# Altium schematic sheet Main.SchDoc: Molniya Relay Attenuator
size A4; DrawnBy: I.Vasilev
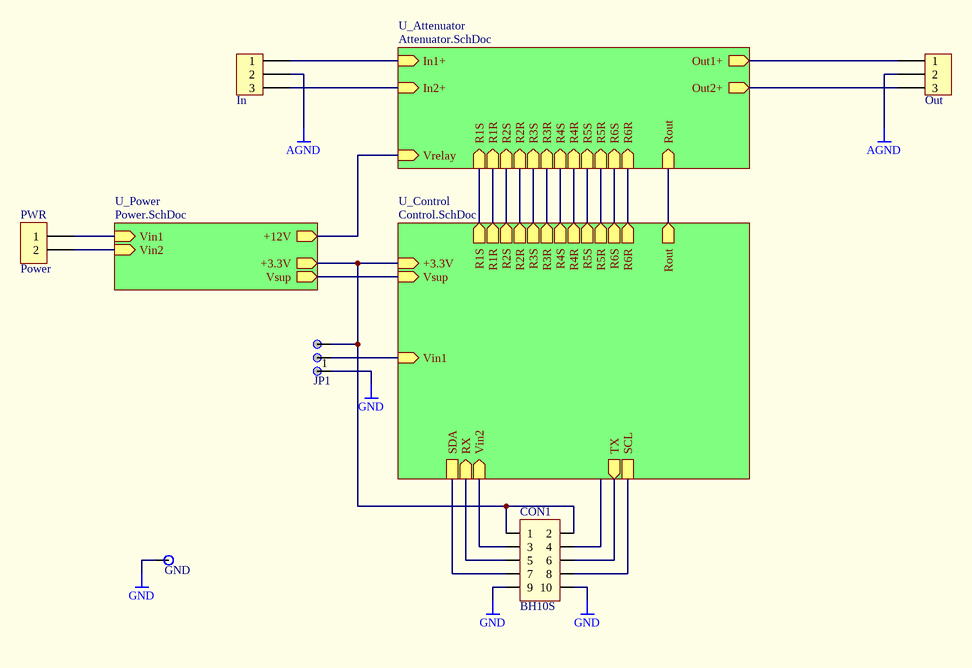
[diagram p0: Main.SchDoc]

## Parts
CON1  BH10S  [BH10S]
GND  TESTPAD  [MISC_PAD-36/65]  (value not drawn)
In  CON3  [CON_WS03S]  (value not drawn)
JP1  Jumper, 3pin  [JP3]  (value not drawn)
Out  CON3  [CON_WS03S]  (value not drawn)
PWR  Power  [CONN_TOP_2P]

## Sub-sheets
U_Attenuator = Attenuator.SchDoc: Vrelay (in), R1S (in), R1R (in), R2S (in), R2R (in), R3S (in), R3R (in), R4S (in), R4R (in), R5S (in), R5R (in), R6S (in), R6R (in), In1+ (in), In2+ (in), Out1+ (out), Out2+ (out), Rout (in)
U_Control = Control.SchDoc: R1S (out), R1R (out), R2S (out), R2R (out), R3S (out), R3R (out), R4S (out), R4R (out), R5S (out), R5R (out), R6S (out), R6R (out), SDA, SCL, Vsup (in), Rout (out), TX (out), RX (in), +3.3V (in), Vin1 (in), Vin2 (in)
U_Power = Power.SchDoc: Vin1 (in), Vin2 (in), +12V (out), +3.3V (out), Vsup (out)

## Nets
AGND: In.2 Out.2
GND: CON1.9 CON1.10 GND.1 JP1.1
NetCON1_1: CON1.1 CON1.2 JP1.3 ; sheet U_Control/+3.3V, sheet U_Power/+3.3V
NetCON1_3: CON1.3 ; sheet U_Control/Vin2
NetCON1_5: CON1.5 ; sheet U_Control/RX
NetCON1_6: CON1.6 ; sheet U_Control/TX
NetCON1_7: CON1.7 ; sheet U_Control/SDA
NetCON1_8: CON1.8 ; sheet U_Control/SCL
NetIn_1: In.1 ; sheet U_Attenuator/In1+
NetIn_3: In.3 ; sheet U_Attenuator/In2+
NetJP1_2: JP1.2 ; sheet U_Control/Vin1
NetOut_1: Out.1 ; sheet U_Attenuator/Out1+
NetOut_3: Out.3 ; sheet U_Attenuator/Out2+
NetPWR_1: PWR.1 ; sheet U_Power/Vin1
NetPWR_2: PWR.2 ; sheet U_Power/Vin2
(unnamed): sheet U_Attenuator/Vrelay, sheet U_Power/+12V
(unnamed): sheet U_Attenuator/R1S, sheet U_Control/R1S
(unnamed): sheet U_Attenuator/R1R, sheet U_Control/R1R
(unnamed): sheet U_Attenuator/R2S, sheet U_Control/R2S
(unnamed): sheet U_Attenuator/R2R, sheet U_Control/R2R
(unnamed): sheet U_Attenuator/R3S, sheet U_Control/R3S
(unnamed): sheet U_Attenuator/R3R, sheet U_Control/R3R
(unnamed): sheet U_Attenuator/R4S, sheet U_Control/R4S
(unnamed): sheet U_Attenuator/R4R, sheet U_Control/R4R
(unnamed): sheet U_Attenuator/R5S, sheet U_Control/R5S
(unnamed): sheet U_Attenuator/R5R, sheet U_Control/R5R
(unnamed): sheet U_Attenuator/R6S, sheet U_Control/R6S
(unnamed): sheet U_Attenuator/R6R, sheet U_Control/R6R
(unnamed): sheet U_Attenuator/Rout, sheet U_Control/Rout
(unnamed): sheet U_Control/Vsup, sheet U_Power/Vsup

Not connected (* = marked no-connect by the designer): CON1 4

## Library data of the parts
CON1 = CON2x5: BH10S-side mounted
In Out = CON3: Connector
JP1 = JP3
PWR = CON2: Connector